# EAGLE design IonSensor (EAGLE 9.6.2)
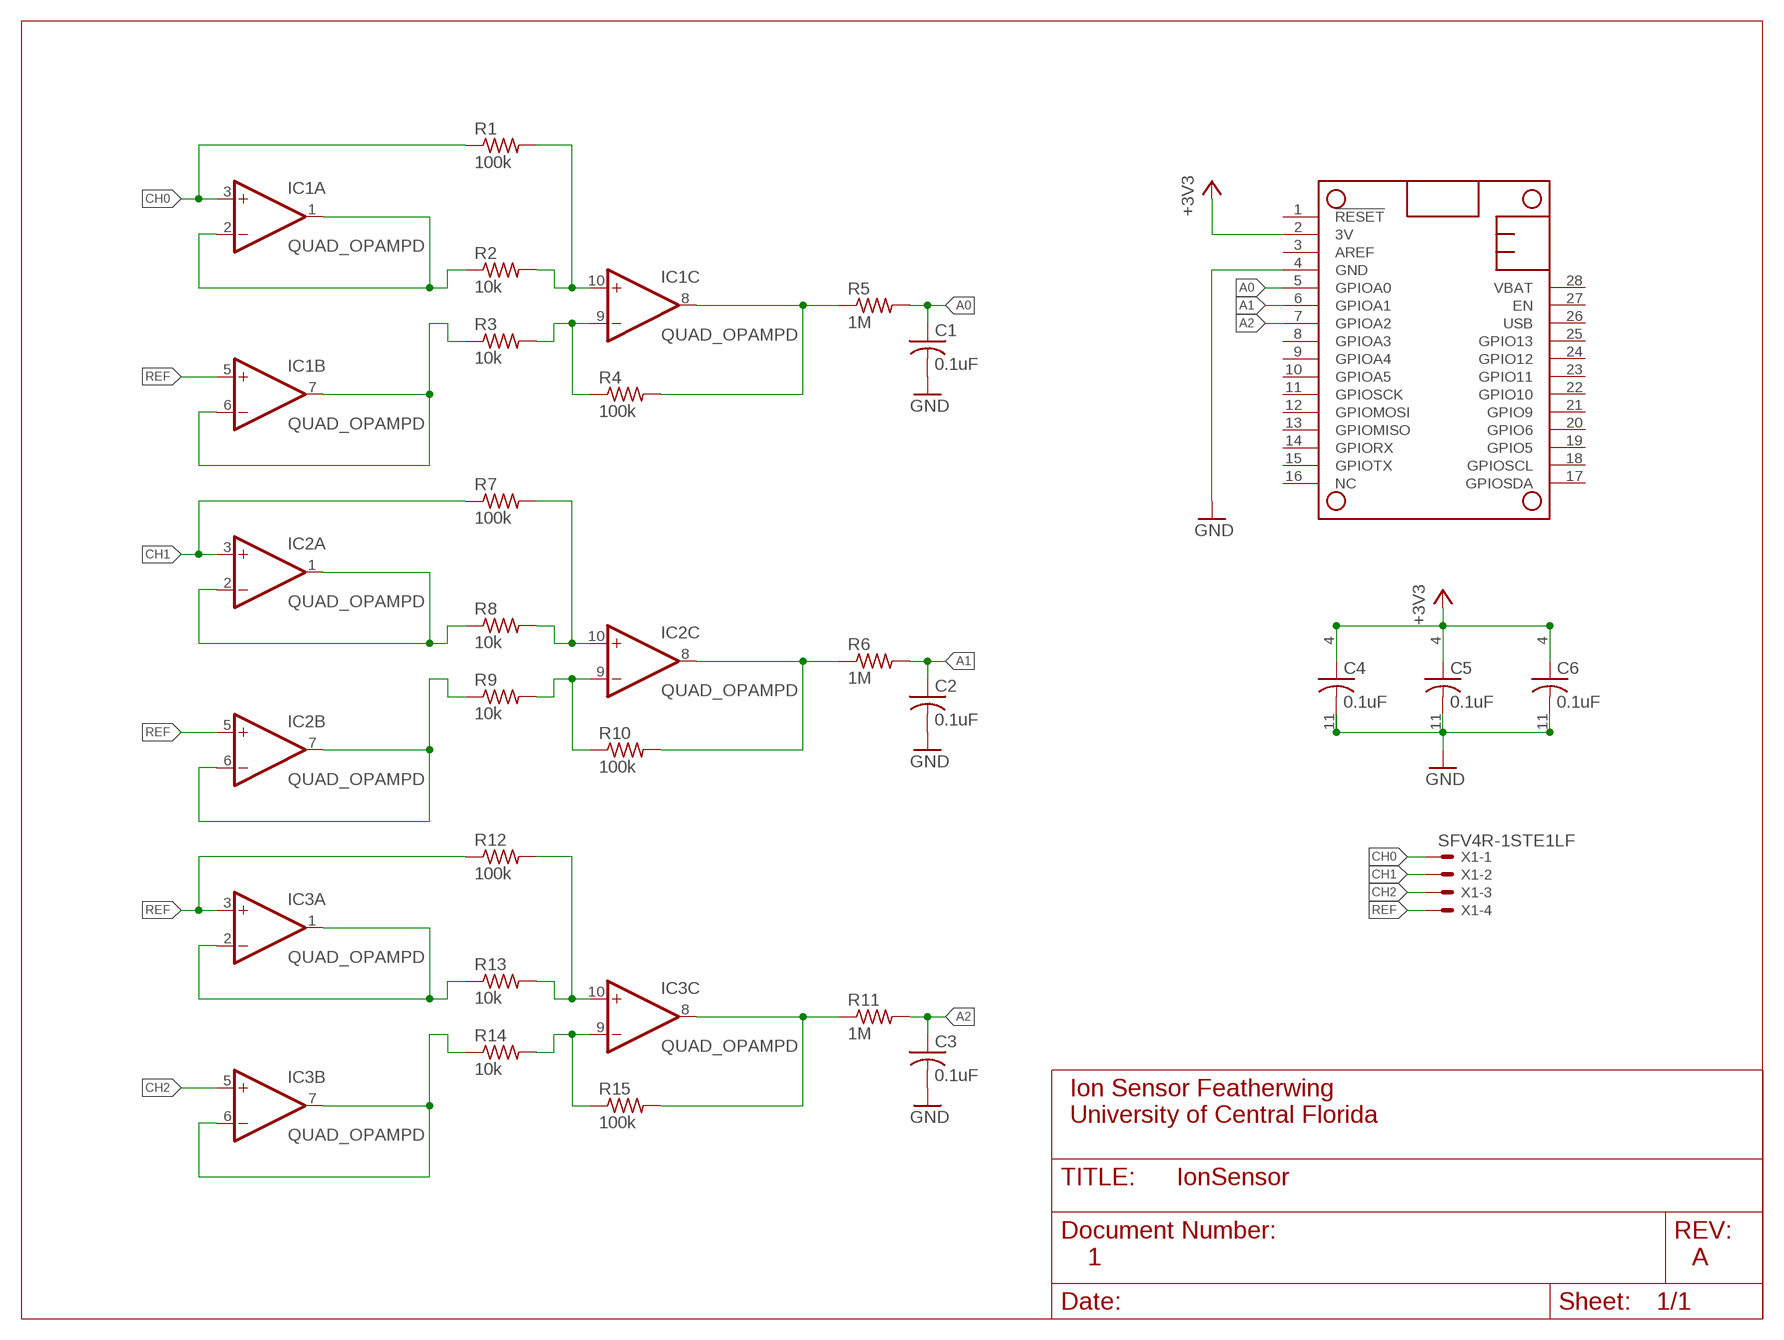
[diagram p0: schematic, sheet 1]

## Parts
C1  0.1uF  C-USC0603  [C0603]
C2  0.1uF  C-USC0603  [C0603]
C3  0.1uF  C-USC0603  [C0603]
C4  0.1uF  C-USC0603  [C0603]
C5  0.1uF  C-USC0603  [C0603]
C6  0.1uF  C-USC0603  [C0603]
IC1  QUAD_OPAMPD  [SO14]
IC2  QUAD_OPAMPD  [SO14]
IC3  QUAD_OPAMPD  [SO14]
MS1  FEATHERWING  [FEATHERWING]
R1  100k  R-US_R0603  [R0603]
R2  10k  R-US_R0603  [R0603]
R3  10k  R-US_R0603  [R0603]
R4  100k  R-US_R0603  [R0603]
R5  1M  R-US_R0603  [R0603]
R6  1M  R-US_R0603  [R0603]
R7  100k  R-US_R0603  [R0603]
R8  10k  R-US_R0603  [R0603]
R9  10k  R-US_R0603  [R0603]
R10  100k  R-US_R0603  [R0603]
R11  1M  R-US_R0603  [R0603]
R12  100k  R-US_R0603  [R0603]
R13  10k  R-US_R0603  [R0603]
R14  10k  R-US_R0603  [R0603]
R15  100k  R-US_R0603  [R0603]
X1  SFV4R-1STE1LF  [SFV4R-1STE1LF]

## Nets
+3V3: C4.1 C5.1 C6.1 IC1.4(P:V+) IC2.4(P:V+) IC3.4(P:V+) MS1.2(3V)
A0: C1.1 MS1.5(GPIOA0) R5.2
A1: C2.1 MS1.6(GPIOA1) R6.2
A2: C3.1 MS1.7(GPIOA2) R11.2
CH0: IC1.3(A:+IN) R1.1 X1.1
CH1: IC2.3(A:+IN) R7.1 X1.2
CH2: IC3.5(B:+IN) X1.3
GND: C1.2 C2.2 C3.2 C4.2 C5.2 C6.2 IC1.11(P:V-) IC2.11(P:V-) IC3.11(P:V-) MS1.4(GND)
N$1: IC1.1(A:OUT) IC1.2(A:-IN) R2.1
N$2: IC1.10(C:+IN) R1.2 R2.2
N$3: IC1.6(B:-IN) IC1.7(B:OUT) R3.1
N$4: IC1.9(C:-IN) R3.2 R4.1
N$5: IC1.8(C:OUT) R4.2 R5.1
N$6: IC2.1(A:OUT) IC2.2(A:-IN) R8.1
N$7: IC2.6(B:-IN) IC2.7(B:OUT) R9.1
N$8: IC2.10(C:+IN) R7.2 R8.2
N$9: IC2.9(C:-IN) R9.2 R10.1
N$10: IC2.8(C:OUT) R6.1 R10.2
N$11: IC3.1(A:OUT) IC3.2(A:-IN) R13.1
N$12: IC3.6(B:-IN) IC3.7(B:OUT) R14.1
N$13: IC3.10(C:+IN) R12.2 R13.2
N$14: IC3.9(C:-IN) R14.2 R15.1
N$15: IC3.8(C:OUT) R11.1 R15.2
REF: IC1.5(B:+IN) IC2.5(B:+IN) IC3.3(A:+IN) R12.1 X1.4
Unconnected: IC1.12(D:+IN) IC1.13(D:-IN) IC1.14(D:OUT) IC2.12(D:+IN) IC2.13(D:-IN) IC2.14(D:OUT) IC3.12(D:+IN) IC3.13(D:-IN) IC3.14(D:OUT) MS1.1(!RESET) MS1.3(AREF) MS1.8(GPIOA3) MS1.9(GPIOA4) MS1.10(GPIOA5) MS1.11(GPIOSCK) MS1.12(GPIOMOSI) MS1.13(GPIOMISO) MS1.14(GPIORX) MS1.15(GPIOTX) MS1.16(NC) MS1.17(GPIOSDA) MS1.18(GPIOSCL) MS1.19(GPIO5) MS1.20(GPIO6) MS1.21(GPIO9) MS1.22(GPIO10) MS1.23(GPIO11) MS1.24(GPIO12) MS1.25(GPIO13) MS1.26(USB) MS1.27(EN) MS1.28(VBAT)

## Notes on the sheet
- Ion Sensor Featherwing
  University of Central Florida
- 1 | A

## Library data of the parts
C1-C6 = adafruit:C-US: CAPACITOR, American symbol
IC1-IC3 = adafruit:QUAD_OPAMP: OP AMP Standard quad package
MS1 = adafruit:FEATHERWING
R1-R15 = adafruit:R-US_: RESISTOR, American symbol
X1 = adafruit:SFV4R-1STE1LF: FPC Connector ZIF for SMT 0.5mm SFV4R-1STE1LF Useful as the LED backlight connector for a PSP display

## Board
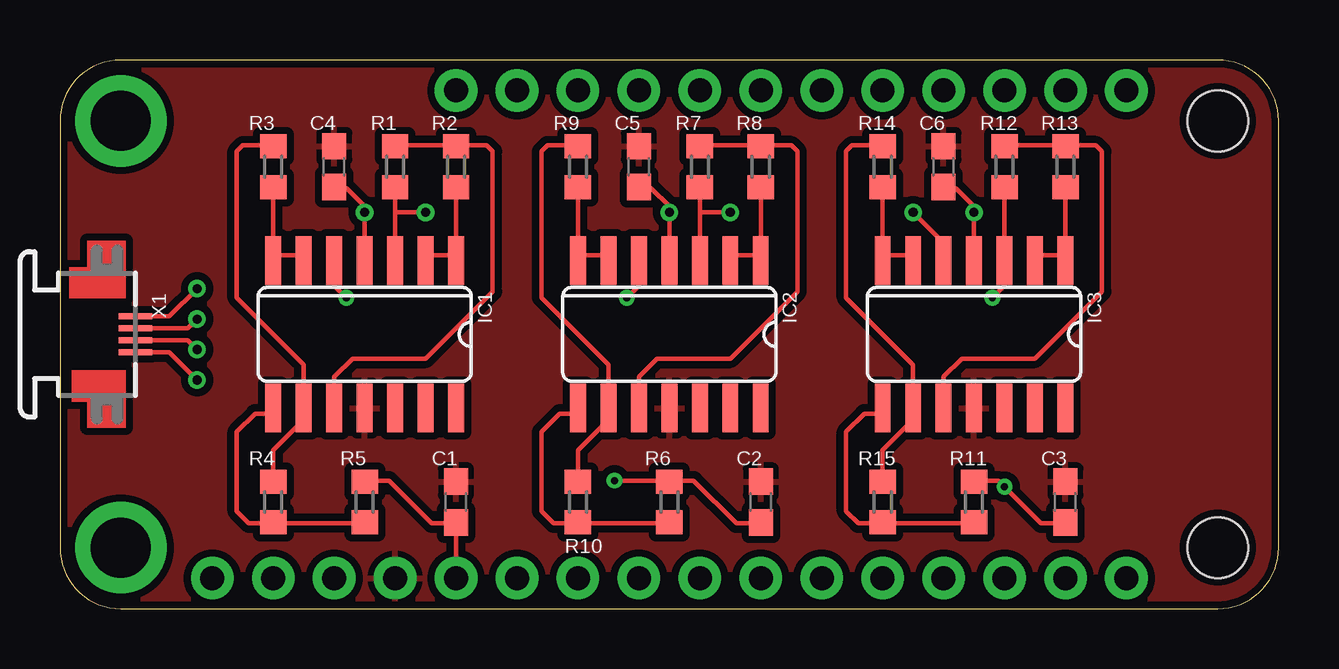
[diagram p1: board, top side]
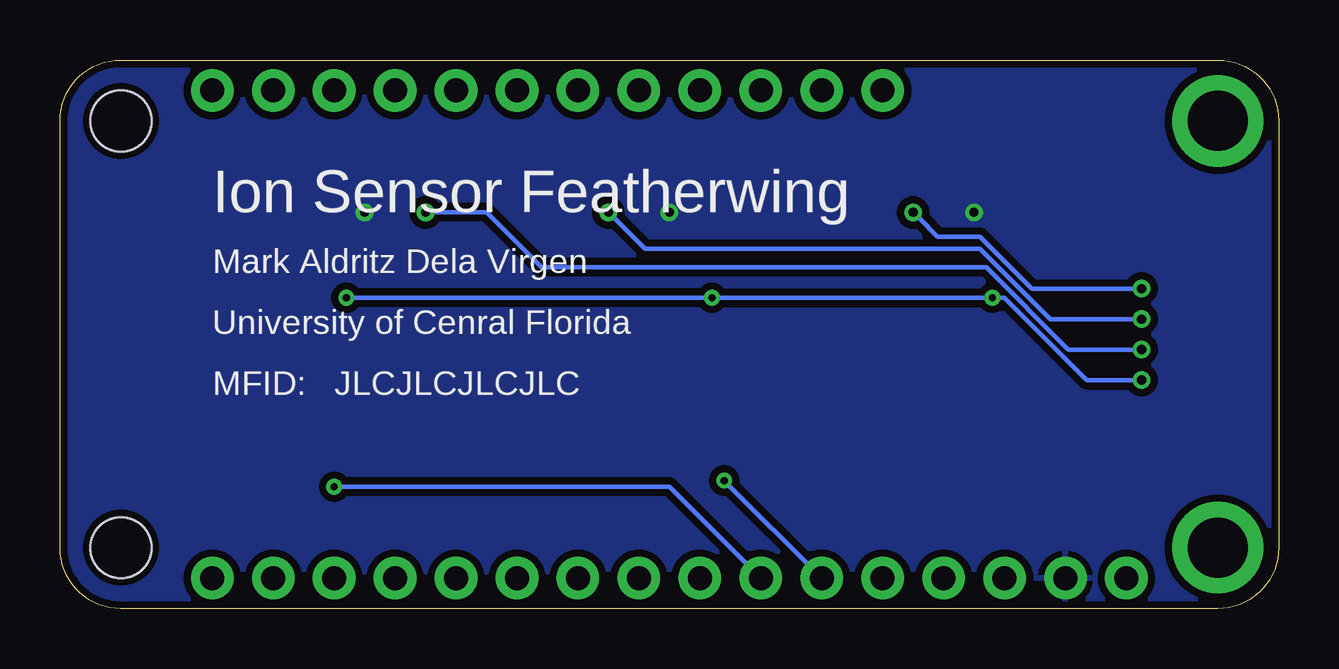
[diagram p2: board, bottom side, seen from below]

Size 50.8 x 22.86 mm. Coordinates in mm from the lower left corner, seen from the top.
Copper layers (1*16): Top 0.035mm / dielectric 1.5mm / Bottom 0.035mm
Design rules "SparkFun-2-Layer-General-JLCPCB": minimum track width 7mil, minimum drill 0.3mm, track to track 7mil, track to pad 7mil, pad to pad 7mil, via to via 7mil, smd to smd 7mil, copper to edge 7mil, drill to drill 7mil, minimum pad ring 7mil, minimum via ring 7mil, stop-mask expansion 3mil, vias tented up to drill 25mil, thermal gap 10mil

### Footprints (pad centres in the part's own frame; a part is rotated, then mirrored left to right if it is on the bottom)
C0603 = smd 1.1 x 1: 1 -0.85,0; 2 0.85,0
SO14 = smd 0.66 x 2.032: 1 -3.81,-3.073; 2 -2.54,-3.073; 3 -1.27,-3.073; 4 0,-3.073; 5 1.27,-3.073; 6 2.54,-3.073; 7 3.81,-3.073; 8 3.81,3.073; 9 2.54,3.073; 10 1.27,3.073; 11 0,3.073; 12 -1.27,3.073; 13 -2.54,3.073; 14 -3.81,3.073
FEATHERWING = drill 1 pad 1.778: 1 6.35,1.27; 2 8.89,1.27; 3 11.43,1.27; 4 13.97,1.27; 5 16.51,1.27; 6 19.05,1.27; 7 21.59,1.27; 8 24.13,1.27; 9 26.67,1.27; 10 29.21,1.27; 11 31.75,1.27; 12 34.29,1.27; 13 36.83,1.27; 14 39.37,1.27; 15 41.91,1.27; 16 44.45,1.27; 17 44.45,21.59; 18 41.91,21.59; 19 39.37,21.59; 20 36.83,21.59; 21 34.29,21.59; 22 31.75,21.59; 23 29.21,21.59; 24 26.67,21.59; 25 24.13,21.59; 26 21.59,21.59; 27 19.05,21.59; 28 16.51,21.59 | drill 2.5 pad 3.81: P$1 2.54,20.32; P$2 2.54,2.54 | hole 2.54: 48.26,20.32; 48.26,2.54
R0603 = smd 1 x 1.1: 1 -0.85,0; 2 0.85,0
SFV4R-1STE1LF = smd 0.25 x 1.4: 1 -0.75,0.6; 2 -0.25,0.6; 3 0.25,0.6; 4 0.75,0.6

### Placement (x,y rotation side)
C1  16.51,4.45 90 top
C2  29.21,4.45 90 top
C3  41.91,4.45 90 top
C4  11.43,18.41 90 top
C5  24.13,18.41 90 top
C6  36.83,18.41 90 top
IC1  12.7,11.43 180 top
IC2  25.4,11.43 180 top
IC3  38.1,11.43 180 top
MS1  0,0 0 top
R1  13.97,18.41 90 top
R2  16.51,18.41 90 top
R3  8.89,18.41 90 top
R4  8.89,4.45 270 top
R5  12.7,4.45 90 top
R6  25.4,4.45 90 top
R7  26.67,18.41 90 top
R8  29.21,18.41 90 top
R9  21.59,18.41 90 top
R10  21.59,4.45 270 top
R11  38.1,4.45 90 top
R12  39.37,18.41 90 top
R13  41.91,18.41 90 top
R14  34.29,18.41 90 top
R15  34.29,4.45 270 top
X1  2.54,11.43 270 top

### Tracks (layer width: path | path; a pad name or v marks a point on that pad's centre or on a via)
+3V3  (via drill 0.38)
  Top 0.178: C4.1 11.43,17.53 11.94,17.53 12.7,16.76 v12.7,16.51 IC1.4 | C5.1 24.13,17.53 24.64,17.53 25.4,16.76 v25.4,16.51 IC2.4 | C6.1 36.83,17.53 37.34,17.53 38.1,16.76 v38.1,16.51 IC3.4
  pour Bottom (isolate 0.305): 0,0 50.8,0 50.8,22.86 0,22.86
A0
  Top 0.178: MS1.5 16.51,3.56 | 16.51,3.56 15.49,3.56 13.72,5.33 12.7,5.33 R5.2 | 16.51,3.56 C1.1
A1  (via drill 0.3)
  Top 0.178: 25.4,5.33 26.42,5.33 28.19,3.56 29.21,3.56 C2.1 | v23.11,5.33 25.4,5.33 | 25.4,5.33 R6.2
  Bottom 0.178: MS1.6 v23.11,5.33
A2  (via drill 0.3)
  Top 0.178: C3.1 41.91,3.56 40.89,3.56 v39.37,5.08 39.12,5.33 38.1,5.33 R11.2
  Bottom 0.178: v39.37,5.08 25.4,5.08 MS1.7
CH0  (via drill 0.38)
  Top 0.178: IC1.3 13.97,16.51 | 13.97,16.51 R1.1 | 13.97,16.51 v15.24,16.51 | X1.1 4.56,12.18 v5.71,13.34
  Bottom 0.178: v5.71,13.34 10.29,13.34 12.45,15.49 14.22,15.49 14.99,16.26 14.99,16.51 v15.24,16.51
CH1  (via drill 0.38)
  Top 0.178: IC2.3 26.67,16.51 | 26.67,16.51 R7.1 | 26.67,16.51 v27.94,16.51 | X1.2 5.33,11.68 v5.71,12.06
  Bottom 0.178: v5.71,12.06 9.53,12.06 12.45,14.99 26.42,14.99 27.69,16.26 27.69,16.51 v27.94,16.51
CH2  (via drill 0.38)
  Top 0.178: X1.3 5.33,11.18 v5.71,10.79 | v35.56,16.51 36.83,15.24 IC3.5
  Bottom 0.178: v5.71,10.79 8.76,10.79 12.19,14.22 30.73,14.22 33.02,16.51 v35.56,16.51
GND
  pour Top (isolate 0.305): 0,0 50.8,0 50.8,22.86 0,22.86
N$1
  Top 0.178: 16.51,14.73 R2.1 | 16.51,14.73 15.24,14.73 IC1.2 | 16.51,14.73 IC1.1
N$2
  Top 0.178: 16.51,19.3 13.97,19.3 R1.2 | 16.51,19.3 17.78,19.3 18.03,19.05 18.03,13.21 15.24,10.41 12.19,10.41 11.43,9.65 IC1.10 | 16.51,19.3 R2.2
N$3
  Top 0.178: 8.89,14.73 R3.1 | 8.89,14.73 10.16,14.73 IC1.6 | 8.89,14.73 IC1.7
N$4
  Top 0.178: R4.1 8.89,6.6 10.16,7.87 IC1.9 10.16,10.16 7.37,12.95 7.37,19.05 7.62,19.3 8.89,19.3 R3.2
N$5
  Top 0.178: 8.89,3.56 12.7,3.56 R5.1 | 8.89,3.56 7.87,3.56 7.37,4.06 7.37,7.37 8.13,8.13 8.89,8.13 IC1.8 | 8.89,3.56 R4.2
N$6
  Top 0.178: 29.21,14.73 R8.1 | 29.21,14.73 27.94,14.73 IC2.2 | 29.21,14.73 IC2.1
N$7
  Top 0.178: 21.59,14.73 R9.1 | 21.59,14.73 22.86,14.73 IC2.6 | 21.59,14.73 IC2.7
N$8
  Top 0.178: 29.21,19.3 26.67,19.3 R7.2 | 29.21,19.3 30.48,19.3 30.73,19.05 30.73,13.21 27.94,10.41 24.89,10.41 24.13,9.65 IC2.10 | 29.21,19.3 R8.2
N$9
  Top 0.178: R10.1 21.59,6.6 22.86,7.87 IC2.9 22.86,10.16 20.07,12.95 20.07,19.05 20.32,19.3 21.59,19.3 R9.2
N$10
  Top 0.178: 21.59,3.56 25.4,3.56 R6.1 | 21.59,3.56 20.57,3.56 20.07,4.06 20.07,7.37 20.83,8.13 21.59,8.13 IC2.8 | 21.59,3.56 R10.2
N$11
  Top 0.178: 41.91,14.73 R13.1 | 41.91,14.73 40.64,14.73 IC3.2 | 41.91,14.73 IC3.1
N$12
  Top 0.178: 34.29,14.73 R14.1 | 34.29,14.73 35.56,14.73 IC3.6 | 34.29,14.73 IC3.7
N$13
  Top 0.178: 41.91,19.3 39.37,19.3 R12.2 | 41.91,19.3 43.18,19.3 43.43,19.05 43.43,13.21 40.64,10.41 37.59,10.41 36.83,9.65 IC3.10 | 41.91,19.3 R13.2
N$14
  Top 0.178: R15.1 34.29,6.6 35.56,7.87 IC3.9 35.56,10.16 32.77,12.95 32.77,19.05 33.02,19.3 34.29,19.3 R14.2
N$15
  Top 0.178: 34.29,3.56 38.1,3.56 R11.1 | 34.29,3.56 33.27,3.56 32.77,4.06 32.77,7.37 33.53,8.13 34.29,8.13 IC3.8 | 34.29,3.56 R15.2
REF  (via drill 0.3, 0.38)
  Top 0.178: IC1.5 11.43,13.46 v11.94,12.95 | v23.62,12.95 24.13,13.46 IC2.5 | X1.4 4.56,10.68 v5.71,9.53 | R12.1 IC3.3 39.37,13.46 v38.86,12.95
  Bottom 0.178: v38.86,12.95 v23.62,12.95 v11.94,12.95 11.43,12.95 8,9.53 v5.71,9.53

### Text on the board
bPlace: Ion Sensor Featherwing | Mark Aldritz Dela Virgen | University of Cenral Florida | JLCJLCJLCJLC | MFID: